# Altium project PDB_V1.1_Core.PrjPcb
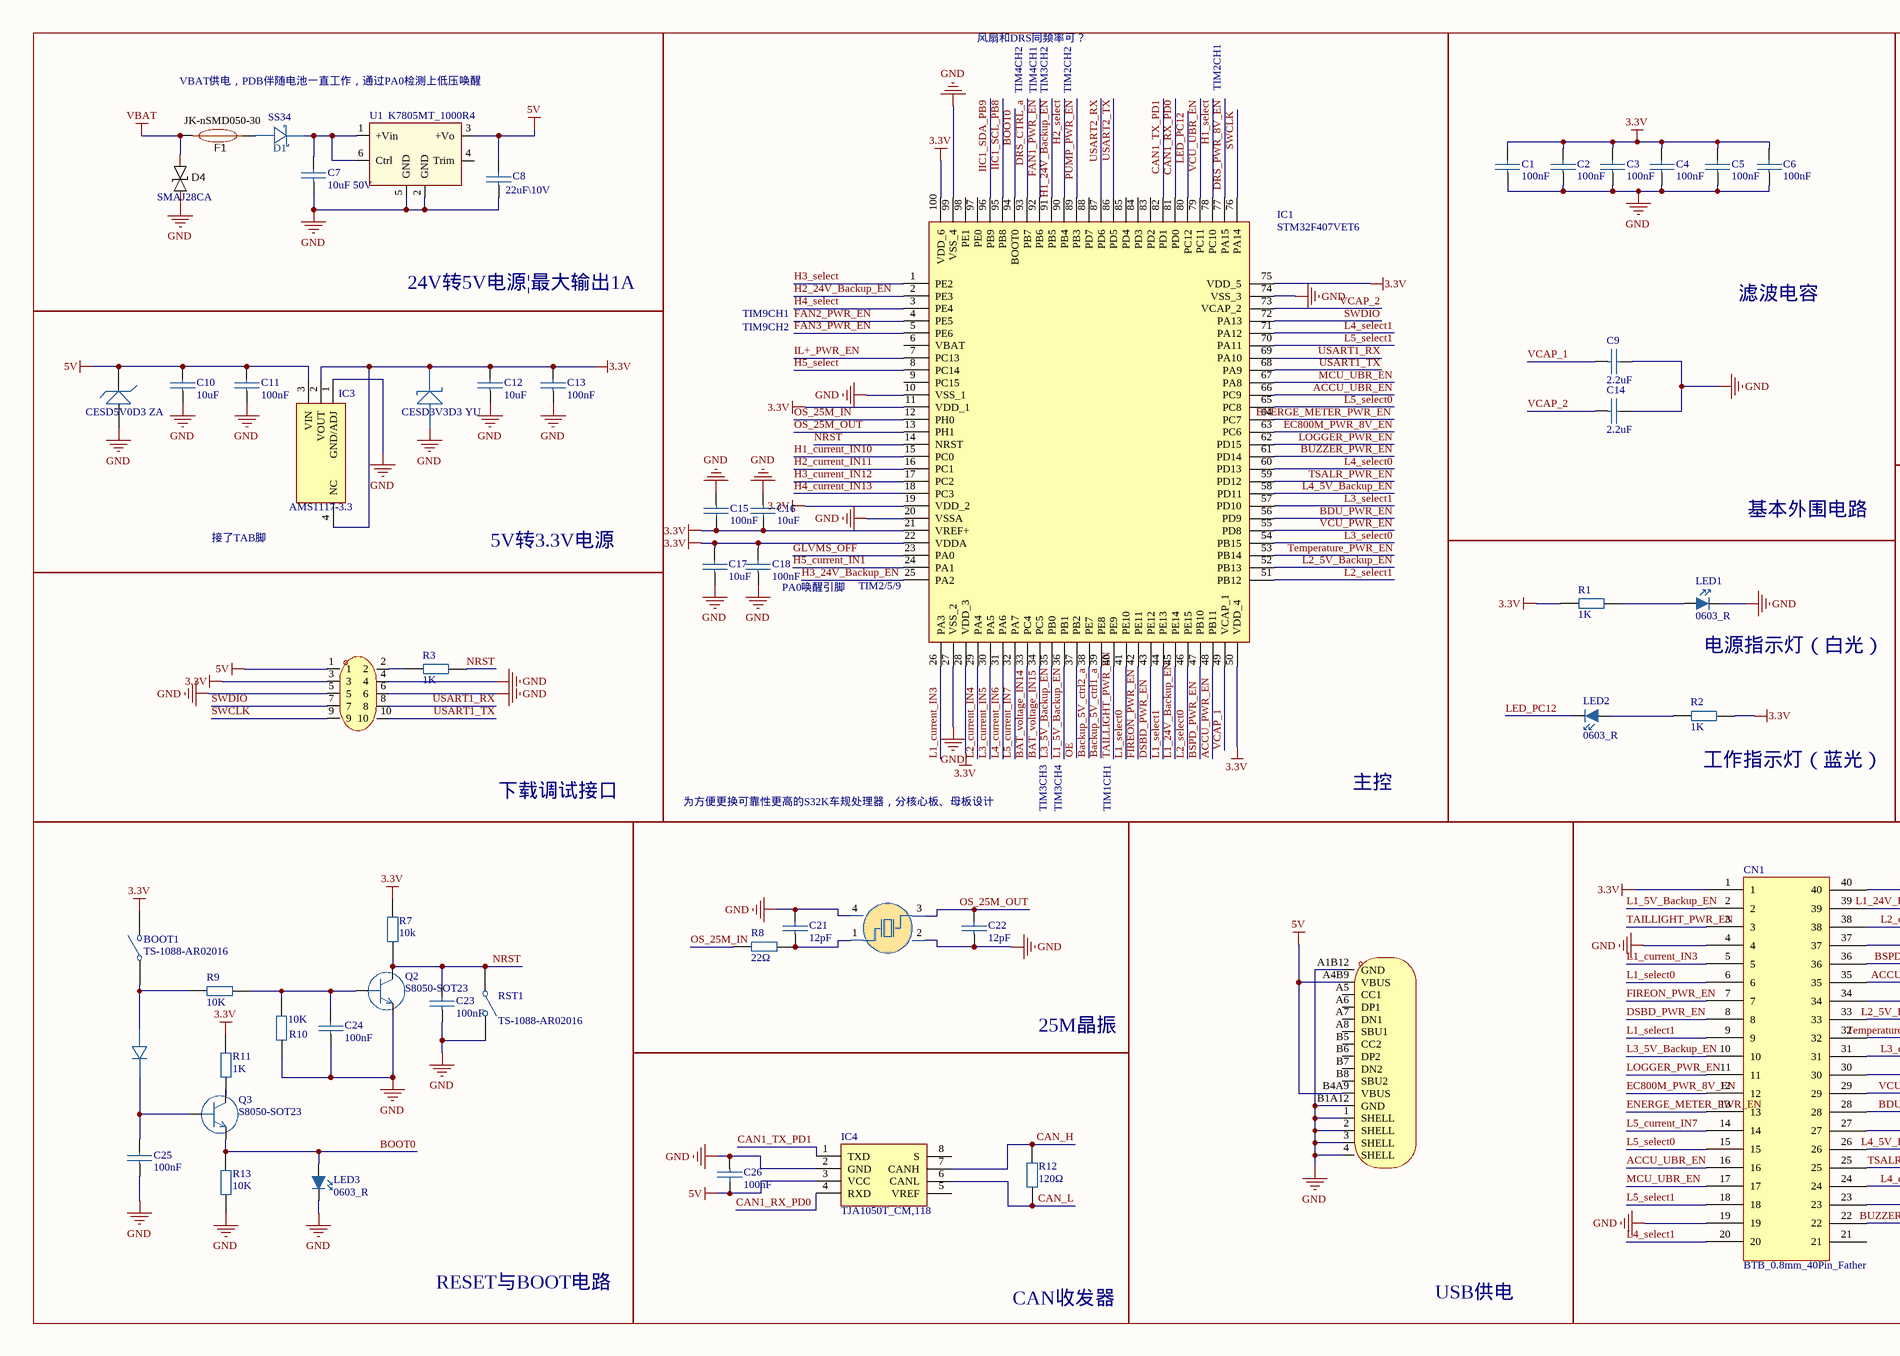
[diagram p0: PDB_Core_v1.1_Sheet.SchDoc, left]
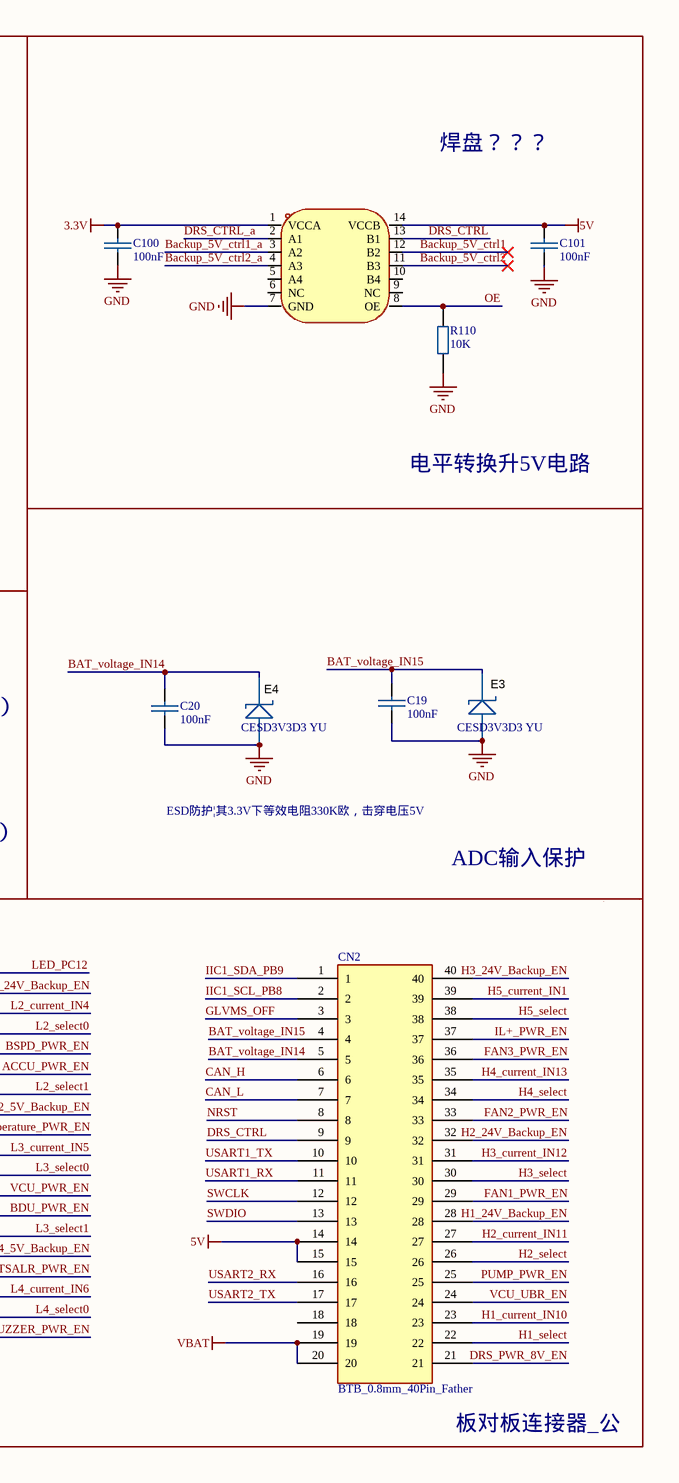
[diagram p1: PDB_Core_v1.1_Sheet.SchDoc, right]
1 sheet, 64 parts. Net scope: global (net labels, ports and power ports of the same name join across sheets).
Board file: PDB_Core_v1.1_PCB.PcbDoc

## Sheet PDB_Core_v1.1_Sheet.SchDoc: PDB1.0_Core
size A2; SheetNumber: 1; SheetTotal: 1

### Parts
BOOT1  TS-1088-AR02016  [SW-SMD_L3.9-W3.0-P4.45]
C1  100nF  [CAPC1608X08N__0603CAPUNPOLE]
C2  100nF  [CAPC1608X08N__0603CAPUNPOLE]
C3  100nF  [CAPC1608X08N__0603CAPUNPOLE]
C4  100nF  [CAPC1608X08N__0603CAPUNPOLE]
C5  100nF  [CAPC1608X08N__0603CAPUNPOLE]
C6  100nF  [CAPC1608X08N__0603CAPUNPOLE]
C7  10uF 50V  [CAPC3216X16N_1206CAPUNPOLE]
C8  22uF\10V  [CAPC1608X08N__0603CAPUNPOLE]
C9  2.2uF  [CAPC1608X08N__0603CAPUNPOLE]
C10  10uF  [CAPC1608X08N__0603CAPUNPOLE]
C11  100nF  [CAPC1608X08N__0603CAPUNPOLE]
C12  10uF  [CAPC1608X08N__0603CAPUNPOLE]
C13  100nF  [CAPC1608X08N__0603CAPUNPOLE]
C14  2.2uF  [CAPC1608X08N__0603CAPUNPOLE]
C15  100nF  [CAPC1608X08N__0603CAPUNPOLE]
C16  10uF  [CAPC1608X08N__0603CAPUNPOLE]
C17  10uF  [CAPC1608X08N__0603CAPUNPOLE]
C18  100nF  [CAPC1608X08N__0603CAPUNPOLE]
C19  100nF  [CAPC1608X08N__0603CAPUNPOLE]
C20  100nF  [CAPC1608X08N__0603CAPUNPOLE]
C21  12pF  [CAPC1608X08N__0603CAPUNPOLE]
C22  12pF  [CAPC1608X08N__0603CAPUNPOLE]
C23  100nF  [CAPC1608X08N__0603CAPUNPOLE]
C24  100nF  [CAPC1608X08N__0603CAPUNPOLE]
C25  100nF  [CAPC1608X08N__0603CAPUNPOLE]
C26  100nF  [CAPC1608X08N__0603CAPUNPOLE]
C100  100nF  [CAPC1608X08N__0603CAPUNPOLE]
C101  100nF  [CAPC1608X08N__0603CAPUNPOLE]
CN1  BTB_0.8mm_40Pin_Father  [BTB_0.8mm_40PIN_F]
CN2  BTB_0.8mm_40Pin_Father  [BTB_0.8mm_40PIN_F]
D1  SS34  [SMA_L4.3-W2.6-LS5.2-RD]
D3  1N4148WS_C2128  [SOD-323_L1.8-W1.3-LS2.5-RD]  (value not drawn)
D4  SMAJ28CA  [SMA_L4.3-W2.5-LS5.0-BI]
E1  CESD5V0D3 ZA  [SOD-323_L1.8-W1.3-LS2.5-RD]
E2  CESD3V3D3 YU  [SOD-323_L1.8-W1.3-LS2.5-RD]
E3  CESD3V3D3 YU  [SOD-323_L1.8-W1.3-LS2.5-RD]
E4  CESD3V3D3 YU  [SOD-323_L1.8-W1.3-LS2.5-RD]
F1  JK-nSMD050-30  [F1206]
IC1  STM32F407VET6  [QFP50P1600X1600X160-100N]
IC3  AMS1117-3.3  [SOT229P700X180-4N]
IC4  TJA1050T_CM,118  [SOIC127P600X175-8N]
LED1  0603_R  [LED0603-RD_RED]
LED2  0603_R  [LED0603-RD_RED]
LED3  0603_R  [LED0603-RD_RED]
Q2  S8050-SOT23  [SOT95P245X110-3N]
Q3  S8050-SOT23  [SOT95P245X110-3N]
R1  1K  [RESC1608X04N_0603RES]
R2  1K  [RESC1608X04N_0603RES]
R3  1K  [RESC3116X06N__1206RES]
R7  10k  [RESC1608X04N_0603RES]
R8  22Ω  [RESC1608X04N_0603RES]
R9  10K  [RESC1608X04N_0603RES]
R10  10K  [RESC1608X04N_0603RES]
R11  1K  [RESC1608X04N_0603RES]
R12  120Ω  [RESC1608X04N_0603RES]
R13  10K  [RESC1608X04N_0603RES]
R110  10K  [RESC1608X04N_0603RES]
RST1  TS-1088-AR02016  [SW-SMD_L3.9-W3.0-P4.45]
U1  K7805MT_1000R4  [K7805MT_500R4]
U2  ZX-PZ2.54-2-5PZZ  [HDR-TH_10P-P2.54-V-M-R2-C5-S2.54]  (value not drawn)
U3  TXS0104EPWR  [TSSOP-14_L5.0-W4.4-P0.65-LS6.4-BL]  (value not drawn)
USB1  TYPE-C16PIN  [USB-C-SMD_TYPE-C16PIN]  (value not drawn)
X1  X322525MOB4SI  [OSC-SMD_4P-L3.2-W2.5-BL]  (value not drawn)

### Blocks framed on the sheet
24V转5V电源¦最大输出1A: C7 C8 D1 D4 F1 U1
主控: C15-C18 IC1
ADC输入保护: C19 C20 E3 E4
下载调试接口: R3 U2
RESET与BOOT电路: BOOT1 C23-C25 D3 LED3 Q2 Q3 R7 R9-R11 R13 RST1
25M晶振: C21 C22 R8 X1
USB供电: USB1
板对板连接器_公: CN1 CN2
CAN收发器: C26 IC4 R12

### Nets
3.3V: BOOT1.2(NO) C1.2 C2.2 C3.2 C4.2 C5.2 C6.2 C12.2 C13.2 C15.2 C16.2 C17.2 C18.2 C100.2 CN1.1 E2.1 IC1.11(VDD_1) IC1.19(VDD_2) IC1.21(VREF+) IC1.22(VDDA) IC1.28(VDD_3) IC1.50(VDD_4) IC1.75(VDD_5) IC1.100(VDD_6) IC3.2(VOUT) IC3.4(NC) R1.1 R2.2 R7.2 R11.2 U2.3 U3.1(VCCA)
5V: C8.2 C10.2 C11.2 C26.2 C101.2 CN2.14 CN2.15 E1.1 IC3.3(VIN) IC4.3(VCC) U1.3(+Vo) U2.1 U3.14(VCCB) USB1.A4B9(VBUS) USB1.B4A9(VBUS)
GND: C1.1 C2.1 C3.1 C4.1 C5.1 C6.1 C7.1 C8.1 C9.2 C10.1 C11.1 C12.1 C13.1 C14.2 C15.1 C16.1 C17.1 C18.1 C19.1 C20.1 C21.2 C22.1 C23.1 C24.1 C25.1 C26.1 C100.1 C101.1 CN1.4 CN1.19 D4.1 E1.2 E2.2 E3.2 E4.2 IC1.10(VSS_1) IC1.20(VSSA) IC1.27(VSS_2) IC1.74(VSS_3) IC1.99(VSS_4) IC3.1(GND/ADJ) IC4.2(GND) LED1.1 LED3.1 Q2.2(Emitter) R10.1 R13.1 R110.1 RST1.2(NO) U1.2(GND) U1.5(GND) U2.4 U2.5 U2.6 U3.7(GND) USB1.1(SHELL) USB1.2(SHELL) USB1.3(SHELL) USB1.4(SHELL) USB1.A1B12(GND) USB1.B1A12(GND) X1.2(GND) X1.4(GND)
VBAT: CN2.19 CN2.20 D4.2 F1.1
ACCU_PWR_EN: CN1.35 IC1.48(PB11)
ACCU_UBR_EN: CN1.16 IC1.66(PC9)
Backup_5V_ctrl1: U3.12(B2)
Backup_5V_ctrl1_a: IC1.39(PE8) U3.3(A2)
Backup_5V_ctrl2: U3.11(B3)
Backup_5V_ctrl2_a: IC1.38(PE7) U3.4(A3)
BAT_voltage_IN14: C20.2 CN2.5 E4.1 IC1.33(PC4)
BAT_voltage_IN15: C19.2 CN2.4 E3.1 IC1.34(PC5)
BDU_PWR_EN: CN1.28 IC1.56(PD9)
BOOT0: IC1.94(BOOT0) LED3.2 Q3.2(Emitter) R13.2
BSPD_PWR_EN: CN1.36 IC1.47(PB10)
BUZZER_PWR_EN: CN1.22 IC1.61(PD14)
CAN1_RX_PD0: IC1.81(PD0) IC4.4(RXD)
CAN1_TX_PD1: IC1.82(PD1) IC4.1(TXD)
CAN_H: CN2.6 IC4.7(CANH) R12.2
CAN_L: CN2.7 IC4.6(CANL) R12.1
DRS_CTRL: CN2.9 U3.13(B1)
DRS_CTRL_a: IC1.93(PB7) U3.2(A1)
DRS_PWR_8V_EN: CN2.21 IC1.77(PA15)
DSBD_PWR_EN: CN1.8 IC1.43(PE12)
EC800M_PWR_8V_EN: CN1.12 IC1.63(PC6)
ENERGE_METER_PWR_EN: CN1.13 IC1.64(PC7)
FAN1_PWR_EN: CN2.29 IC1.92(PB6)
FAN2_PWR_EN: CN2.33 IC1.4(PE5)
FAN3_PWR_EN: CN2.36 IC1.5(PE6)
FIREON_PWR_EN: CN1.7 IC1.42(PE11)
GLVMS_OFF: CN2.3 IC1.23(PA0)
H1_24V_Backup_EN: CN2.28 IC1.91(PB5)
H1_current_IN10: CN2.23 IC1.15(PC0)
H1_select: CN2.22 IC1.78(PC10)
H2_24V_Backup_EN: CN2.32 IC1.2(PE3)
H2_current_IN11: CN2.27 IC1.16(PC1)
H2_select: CN2.26 IC1.90(PB4)
H3_24V_Backup_EN: CN2.40 IC1.25(PA2)
H3_current_IN12: CN2.31 IC1.17(PC2)
H3_select: CN2.30 IC1.1(PE2)
H4_current_IN13: CN2.35 IC1.18(PC3)
H4_select: CN2.34 IC1.3(PE4)
H5_current_IN1: CN2.39 IC1.24(PA1)
H5_select: CN2.38 IC1.8(PC14)
IIC1_SCL_PB8: CN2.2 IC1.95(PB8)
IIC1_SDA_PB9: CN2.1 IC1.96(PB9)
IL+_PWR_EN: CN2.37 IC1.7(PC13)
L1_5V_Backup_EN: CN1.2 IC1.36(PB1)
L1_24V_Backup_EN: CN1.39 IC1.45(PE14)
L1_current_IN3: CN1.5 IC1.26(PA3)
L1_select0: CN1.6 IC1.41(PE10)
L1_select1: CN1.9 IC1.44(PE13)
L2_5V_Backup_EN: CN1.33 IC1.52(PB13)
L2_current_IN4: CN1.38 IC1.29(PA4)
L2_select0: CN1.37 IC1.46(PE15)
L2_select1: CN1.34 IC1.51(PB12)
L3_5V_Backup_EN: CN1.10 IC1.35(PB0)
L3_current_IN5: CN1.31 IC1.30(PA5)
L3_select0: CN1.30 IC1.54(PB15)
L3_select1: CN1.27 IC1.57(PD10)
L4_5V_Backup_EN: CN1.26 IC1.58(PD11)
L4_current_IN6: CN1.24 IC1.31(PA6)
L4_select0: CN1.23 IC1.60(PD13)
L4_select1: CN1.20 IC1.71(PA12)
L5_current_IN7: CN1.14 IC1.32(PA7)
L5_select0: CN1.15 IC1.65(PC8)
L5_select1: CN1.18 IC1.70(PA11)
LED_PC12: CN1.40 IC1.80(PC12) LED2.1
LOGGER_PWR_EN: CN1.11 IC1.62(PD15)
MCU_UBR_EN: CN1.17 IC1.67(PA8)
NRST: C23.2 CN2.8 IC1.14(NRST) Q2.3(Collector) R3.2 R7.1 RST1.1(COMMON)
OE: IC1.37(PB2) R110.2 U3.8(OE)
OS_25M_IN: IC1.12(PH0) R8.1
OS_25M_OUT: C22.2 IC1.13(PH1) X1.3(OSC2)
PUMP_PWR_EN: CN2.25 IC1.89(PB3)
SWCLK: CN2.12 IC1.76(PA14) U2.9
SWDIO: CN2.13 IC1.72(PA13) U2.7
TAILLIGHT_PWR_EN: CN1.3 IC1.40(PE9)
Temperature_PWR_EN: CN1.32 IC1.53(PB14)
TSALR_PWR_EN: CN1.25 IC1.59(PD12)
USART1_RX: CN2.11 IC1.69(PA10) U2.8
USART1_TX: CN2.10 IC1.68(PA9) U2.10
USART2_RX: CN2.16 IC1.87(PD6)
USART2_TX: CN2.17 IC1.86(PD5)
VCAP_1: C9.1 IC1.49(VCAP_1)
VCAP_2: C14.1 IC1.73(VCAP_2)
VCU_PWR_EN: CN1.29 IC1.55(PD8)
VCU_UBR_EN: CN2.24 IC1.79(PC11)
NetBOOT1_1: BOOT1.1(COMMON) D3.2(A) R9.1
NetC7_2: C7.2 D1.1(K) U1.1(+Vin) U1.6(Ctrl)
NetC21_1: C21.1 R8.2 X1.1(OSC1)
NetC24_2: C24.2 Q2.1(Base) R9.2 R10.2
NetC25_2: C25.2 D3.1(K) Q3.1(Base)
NetD1_2: D1.2(A) F1.2
NetLED1_2: LED1.2 R1.2
NetLED2_2: LED2.2 R2.1
NetQ3_3: Q3.3(Collector) R11.1
NetR3_1: R3.1 U2.2

Not connected (* = marked no-connect by the designer): CN1 21; CN2 18; IC1 6(VBAT) 9(PC15) 83(PD2) 84(PD3) 85(PD4) 88(PD7) 97(PE0) 98(PE1); IC4 5(VREF) 8(S); U1 4(Trim); U3 5(A4) 6(NC) 9(NC) 10(B4); USB1 A5(CC1) A6(DP1) A7(DN1) A8(SBU1) B5(CC2) B6(DP2) B7(DN2) B8(SBU2)

### Notes on the sheet
- 风扇和DRS同频率可？
- VBAT供电，PDB伴随电池一直工作，通过PA0检测上低压唤醒
- TIM4CH2
- TIM4CH1
- TIM3CH2
- TIM2CH2
- TIM2CH1
- 焊盘？？？
- 滤波电容
- TIM9CH1
- TIM9CH2
- 电平转换升5V电路
- 接了TAB脚
- 5V转3.3V电源
- 基本外围电路
- (near C18) PA0唤醒引脚
- (near IC1) TIM2/5/9
- (near LED1) 电源指示灯（白光）
- (near R2) 工作指示灯（蓝光）
- ESD防护¦其3.3V下等效电阻330K欧，击穿电压5V
- 为方便更换可靠性更高的S32K车规处理器，分核心板、母板设计
- TIM3CH3
- TIM3CH4
- TIM1CH1
- ENG:
- DSN:
- APPROVALS
- DATE
- PROJECT REVISION:
- Vehicle Number:
- E33
- DOCUMENT REVISION:
- Wuhan University of Techonology
- Formula Student Electric Racing Team
- No. 122, Luoshi Road, Wuhan
- Hubei Provence, China
- Design Item:
- CHK:
- BOM:
- REFERENCE DOCUMENTS
- TITLE
- FAB DWG:
- PCB DWG:
- ASSY DWG:
- SCALE:
- A1
- SIZE
- FILE NAME
- WUTE racing team
- SHEET
- OF
- REV

### Library data of the parts
BOOT1 RST1 = TS-1088-AR02016: Switch; Manufacturer_Name: XUNPU; Datasheet Link: https://www.xunpudianzi.com/uploads/pdf/TS-1088-ARXXX.pdf; Height: 2mm; Manufacturer_Part_Number: TS-1088-AR02016
C1-C6 C9-C26 C100 C101 = SMD_MLCC: Std MLCC Cap; voltage rating: ?V
  C1-C6 C11 C13 C15 C18-C20 C23-C26 C100 C101: Type: 100nF
  C9 C14: Type: 2.2uF
  C10 C12 C16 C17: Type: 10uF
  C21 C22: Type: 12pF
C7 C8 = SMD_MLCC: Std MLCC Cap
  C7: Type: 10uF 50V
  C8: Type: 22uF\10V
CN1 CN2 = BTB_0.8mm_40Pin_Father: System: Connector
D1 = SS34_C8678: 二极管配置:独立式;直流反向耐压(Vr):40V;平均整流电流(Io):3A;正向压降(Vf):550mV@3A; C8678; Manufacturer: MDD; Add into BOM: yes; Diode Configuration: 独立式; Reverse Voltage (Vr): 40V; Average Rectified Current (Io): 3A; Reverse Leakage Current (Ir): 500uA@40V; Name: SS34; Symbol: SS34_C8678; Device: SS34_C8678; LCSC Part Name: 40V 3A 550mV@3A; Supplier Part: C8678; Manufacturer Part: SS34; Supplier Footprint: SMA(DO-214AC); Datasheet: https://atta.szlcsc.com/upload/public/pdf/source/20230314/A80AE34493C69B89E2F4B1712F433538.pdf; Supplier: LCSC; Convert to PCB: yes; Forward Voltage (Vf@If): 550mV@3A
D3 = 1N4148WS_C2128: 二极管配置:独立式;功率:200mW;直流反向耐压(Vr):100V;平均整流电流(Io):150mA;正向压降(Vf):1.25V@150mA;反向电流(Ir):1uA@75V;反向恢复时间(trr):4ns;工作温度:+150℃@(Tj);; Manufacturer: CJ(江苏长电/长晶); Symbol: 1N4148WS T4; Add into BOM: yes; Diode Configuration: 独立式; Power Dissipation: 200mW; Reverse Voltage (Vr): 100V; Average Rectified Current (Io): 150mA; Reverse Recovery Time (trr): 4ns; Name: 1N4148WS; Device: 1N4148WS_C2128; LCSC Part Name: 100V 150mA 4ns T4; Supplier Part: C2128; Manufacturer Part: 1N4148WS; Supplier Footprint: SOD-323; Supplier: LCSC; Convert to PCB: yes; Forward Voltage (Vf@If): 1.25V@150mA; Reverse Leakage Current: 1uA@75V; Operating Temperature: +150℃@(Tj)
D4 = SMAJ28CA_C353457: C353457; Manufacturer: 晶导微电子; Add into BOM: yes; Reverse Stand-Off Voltage (Vrwm): 28V; Maximum Clamping Voltage: 45.4V; Peak Pulse Current (Ipp)@10/1000us: 8.8A; Breakdown Voltage: 31.1V; Reverse Leakage Current (Ir): 1uA; Type: TVS; Symbol: SMAJ28CA_C353457; Device: SMAJ28CA_C353457; LCSC Part Name: 双向TVS 28V截止 8.8A峰值脉冲; Supplier Part: C353457; Manufacturer Part: SMAJ28CA; Supplier Footprint: SMA; JLCPCB Part Class: Extended Part; Datasheet: https://atta.szlcsc.com/upload/public/pdf/source/20190103/C353498_9C52E1B7CA7D9691073072057BB1DA1A.pdf; Supplier: LCSC; Convert to PCB: yes
E1 = CESD5V0D3 ZA: Manufacturer: CJ(江苏长电/长晶); Add into BOM: yes; Polarity: 单向; Breakdown Voltage (VBR): 6.2V; Peak Pulse Current(Ipp)@8/20us: 15A; Reverse Stand-Off Voltage (Vrwm): 5V; Clamping Voltage@Ipp: 15.5V; Name: CESD5V0D3 ZA; Symbol: CESD5V0D3 ZA; Device: CESD5V0D3 ZA; LCSC Part Name: 单向ESD; Supplier Part: C22643; Manufacturer Part: CESD5V0D3 ZA; Supplier Footprint: SOD-323; JLCPCB Part Class: Extended Part; Datasheet: https://atta.szlcsc.com/upload/public/pdf/source/20140301/1457707004115.pdf; Supplier: LCSC; Convert to PCB: yes
E2-E4 = CESD3V3D3 YU: 极性:单向;反向截止电压(Vrwm):3.3V;击穿电压(VBR):5V;钳位电压(Vc)@Ipp:13V;; Manufacturer: CJ(江苏长电/长晶); Add into BOM: yes; Polarity: 单向; Reverse Stand-Off Voltage (Vrwm): 3.3V; Breakdown Voltage (VBR): 5V; Peak Pulse Current(Ipp)@8/20us: 16A; Clamping Voltage@Ipp: 13V; Name: CESD3V3D3 YU; Symbol: CESD3V3D3; Device: CESD3V3D3 YU; LCSC Part Name: 单向ESD; Supplier Part: C38388; Manufacturer Part: CESD3V3D3 YU; Supplier Footprint: SOD-323; Datasheet: https://atta.szlcsc.com/upload/public/pdf/source/20150915/1457707371129.pdf; Supplier: LCSC; Convert to PCB: yes
F1 = JK-nSMD050-30: C720075; Manufacturer: JK(金科); Symbol: JK-NSMD050-30V; Add into BOM: yes; Operating Voltage (Max): 30V; Current Rating (Max): 100A; Hold Current: 500mA; Trip Current: 1A; Power Dissipation: 600mW; Resistance - Initial (Ri) (Min): 150mΩ; Resistance - Post Trip (R1) (Max): 300mΩ; Maximum Time to Trip: 100ms; Name: JK-nSMD050-30; Device: JK-nSMD050-30; LCSC Part Name: 30V 500mA 1206自恢复; Supplier Part: C720075; Manufacturer Part: JK-nSMD050-30; Supplier Footprint: 1206; JLCPCB Part Class: Extended Part; Datasheet: https://atta.szlcsc.com/upload/public/pdf/source/20200810/C720075_06AF2D4541537091880CC35F0EFB49F8.pdf; Supplier: LCSC; Convert to PCB: yes; Operating Temperature: -40℃~+85℃
IC1 = STM32F407VET6: Integrated Circuit; Manufacturer_Name: STMicroelectronics; Datasheet Link: http://www.st.com/web/en/resource/technical/document/datasheet/DM00037051.pdf; Height: 1.6mm; Manufacturer_Part_Number: STM32F407VET6; Mouser Part Number: 511-STM32F407VET6; Mouser Price/Stock: https://www.mouser.co.uk/ProductDetail/STMicroelectronics/STM32F407VET6?qs=Z8%252BeY1k3TIJFAMMqSR%252BGtw%3D%3D; Arrow Part Number: STM32F407VET6; Arrow Price/Stock: https://www.arrow.com/en/products/stm32f407vet6/stmicroelectronics?region=nac
IC3 = AMS1117-3.3: Integrated Circuit; Manufacturer_Name: Advanced; Datasheet Link: https://datasheet.datasheetarchive.com/originals/distributors/Datasheets-28/DSA-550594.pdf; Height: 1.8mm; Manufacturer_Part_Number: AMS1117-3.3
IC4 = TJA1050T_CM,118: Integrated Circuit; Manufacturer_Name: NXP; Manufacturer_Part_Number: TJA1050T/CM,118; Datasheet Link: http://www.nxp.com/docs/en/data-sheet/TJA1050.pdf; Height: 1.75mm; Mouser Part Number: 771-TJA1050T/CM118; Mouser Price/Stock: https://www.mouser.co.uk/ProductDetail/NXP-Semiconductors/TJA1050T-CM118?qs=5XOdhvmYM0NFFspw0VP5sA%3D%3D; Arrow Part Number: TJA1050T/CM,118; Arrow Price/Stock: https://www.arrow.com/en/products/tja1050tcm118/nxp-semiconductors?region=europe
LED1-LED3 = LED: Light Emitting Diode; Type: 0805-R; Type2: DIP-HDR1*2-R
Q2 Q3 = S8050: Jellybeam NPN; Type: S8050-SOT23
R1-R3 R7-R13 R110 = SMD_Resistor: Std Resistor; power rating: 100mW; voltage rating: 75V
  R1-R3 R11: Type: 1K
  R7: Type: 10k
  R8: Type: 22Ω
  R9 R10 R13 R110: Type: 10K
  R12: Type: 120Ω
U1 = K78052MT_1000R4
U2 = ZX-PZ2.54-2-5PZZ: Manufacturer: Megastar(兆星); Add into BOM: yes; Pin Structure: 2x5P; Pitch: 2.54mm; Circluar Pins/Square Pins: 方针; Current Rating (Max): 3A; Voltage Rating (Max): 1kV; Soldering Temperature(Max): 260℃@5s; Symbol: ZX-PZ2.54-2-5PZZ; Device: ZX-PZ2.54-2-5PZZ; Supplier: LCSC; Supplier Part: C7501276; Manufacturer Part: ZX-PZ2.54-2-5PZZ; JLCPCB Part Class: Extended Part; LCSC Part Name: 间距:2.54mm 2x5P 直插 方针; Supplier Footprint: 插件,P=2.54mm; Datasheet: https://atta.szlcsc.com/upload/public/pdf/source/20231122/7DD2FA5A7FDBC10CDDB6051CB6BC6AD1.pdf; Convert to PCB: yes; Row Spacing: 2.54mm; Mounting Type: 直插; Number of Rows: 双排; Number of Pins: 5P; Length of Mating Pin: 6mm; Insulation Height: 2.5mm; Length of End Connection Pin: 3mm; Contact Material: 黄铜; Contact Plating: 金; Operating Temperature Range: -40℃~+105℃; Color: 黑色
U3 = TXS0104EPWR: C44955 电平转换芯片; Manufacturer: TI(德州仪器); Add into BOM: yes; Channel Type: 双向; Data Rate: 24Mbps; Supply Voltage (VCCA): 1.65V~3.6V; Supply Voltage (VCCB): 2.3V~5.5V; Number of Circuits: 1; Channels per Circuit: 4; Output Type: 推挽式；开路漏极; Name: TXS0104EPWR; Symbol: TXS0104EPWR; Device: TXS0104EPWR; LCSC Part Name: TXS0104EPWR; Supplier Part: C44955; Manufacturer Part: TXS0104EPWR; Supplier Footprint: TSSOP-14; JLCPCB Part Class: Extended Part; Datasheet: https://www.ti.com/cn/lit/gpn/txs0104e; Supplier: LCSC; Convert to PCB: yes; Operating Temperature: -40℃~+85℃; Features: 自动方向检测
USB1 = TYPE-C16PIN: C393939; Manufacturer: SHOU HAN(首韩); Add into BOM: yes; Connector Type: Type-C; Gender: 母; Number of Ports: 1; Number of Contacts: 16P; Current Rating - Power (Max): 3A; Symbol: TYPE-C16PIN; Device: TYPE-C16PIN; Supplier: LCSC; Supplier Part: C393939; Manufacturer Part: TYPE-C16PIN; JLCPCB Part Class: Extended Part; LCSC Part Name: Type-C 母 卧贴; Supplier Footprint: SMD; Datasheet: https://atta.szlcsc.com/upload/public/pdf/source/20190521/C393939_7B9043D4CF1026AF443AB60D91FBCD5C.pdf; Convert to PCB: yes; Standard: -; Mounting Style: 卧贴; Operating Temperature Range: -40℃~+85℃
X1 = X322525MOB4SI: 频率:25MHz;频率公差:±10ppm;负载电容:12pF;; Manufacturer: YXC(扬兴晶振); Name: 25MHz; Add into BOM: yes; Crystal Type: 贴片无源晶振; Value: 25MHz; Frequency Tolerance: ±10ppm; Frequency Stability: ±30ppm; Load Capacitance: 12pF; Symbol: X322525MOB4SI; Device: X322525MOB4SI; LCSC Part Name: 25MHz ±10ppm 12pF YSX321SL; Supplier Part: C9006; Manufacturer Part: X322525MOB4SI; Supplier Footprint: SMD3225-4P; Datasheet: https://atta.szlcsc.com/upload/public/pdf/source/20210329/C112971_1F611BDC486E193C1706F6D8EB5AA189.pdf; Supplier: LCSC; Convert to PCB: yes; Operating Temperature: -40℃~+85℃